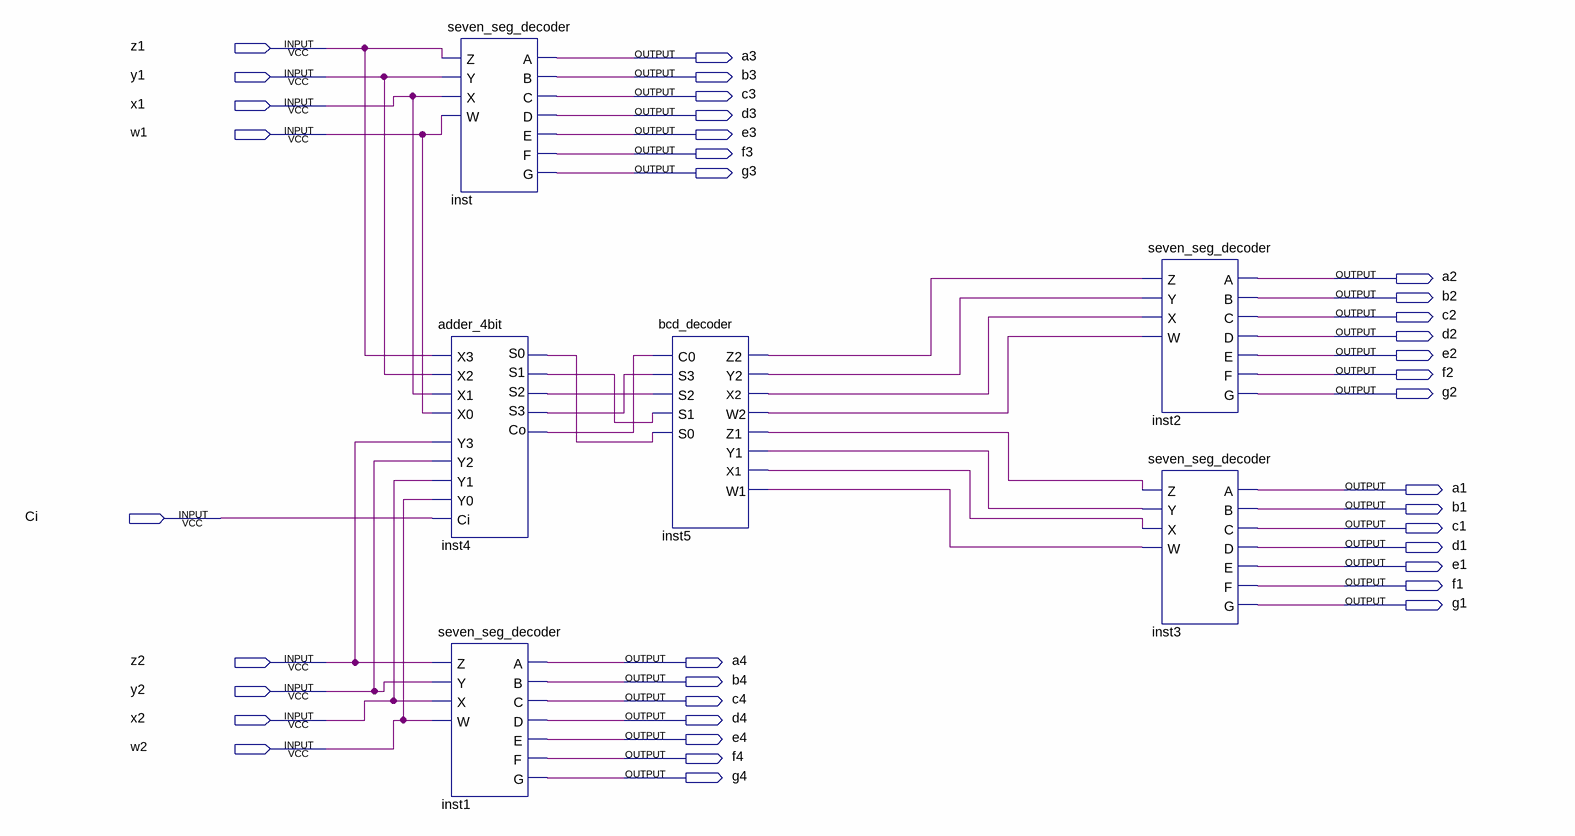
[diagram p0: schematic sheet]
// Quartus schematic lab06.bdf as structural Verilog: 6 symbols, 37 pins
module lab06 (
  input  z1,
  input  y1,
  input  x1,
  input  w1,
  input  Ci,
  input  z2,
  input  y2,
  input  x2,
  input  w2,
  output a3,
  output b3,
  output c3,
  output d3,
  output e3,
  output f3,
  output g3,
  output a2,
  output b2,
  output c2,
  output d2,
  output e2,
  output f2,
  output g2,
  output a1,
  output b1,
  output c1,
  output d1,
  output e1,
  output f1,
  output g1,
  output a4,
  output b4,
  output c4,
  output d4,
  output e4,
  output f4,
  output g4
);

  wire inst4_co, inst4_s0, inst4_s1, inst4_s2, inst4_s3, inst5_w1, inst5_w2, inst5_x1, inst5_x2, inst5_y1,
       inst5_y2, inst5_z1, inst5_z2;

  seven_seg_decoder inst (.Z(z1), .Y(y1), .X(x1), .W(w1), .A(a3), .B(b3), .C(c3), .D(d3), .E(e3), .F(f3), .G(g3));
  adder_4bit inst4 (
    .X3(z1), .Y3(z2), .X2(y1), .Y2(y2), .X1(x1), .Y1(x2), .X0(w1), .Y0(w2), .Ci(Ci), .S0(inst4_s0),
    .S1(inst4_s1), .S2(inst4_s2), .S3(inst4_s3), .Co(inst4_co));
  seven_seg_decoder inst1 (.Z(z2), .Y(y2), .X(x2), .W(w2), .A(a4), .B(b4), .C(c4), .D(d4), .E(e4), .F(f4), .G(g4));
  bcd_decoder inst5 (
    .C0(inst4_co), .S3(inst4_s3), .S2(inst4_s2), .S1(inst4_s1), .S0(inst4_s0), .Z2(inst5_z2), .Y2(inst5_y2),
    .X2(inst5_x2), .W2(inst5_w2), .Z1(inst5_z1), .Y1(inst5_y1), .X1(inst5_x1), .W1(inst5_w1));
  seven_seg_decoder inst2 (
    .Z(inst5_z2), .Y(inst5_y2), .X(inst5_x2), .W(inst5_w2), .A(a2), .B(b2), .C(c2), .D(d2), .E(e2), .F(f2),
    .G(g2));
  seven_seg_decoder inst3 (
    .Z(inst5_z1), .Y(inst5_y1), .X(inst5_x1), .W(inst5_w1), .A(a1), .B(b1), .C(c1), .D(d1), .E(e1), .F(f1),
    .G(g1));
endmodule
